# Altium schematic sheet S7CAS-PLEIADES-CARTE-MERE_P02_DDR3.SchDoc
size Tabloid; DocumentNumber: 8; SheetNumber: 8; SheetTotal: 14; Size: 11x17; Sheet_Name: DDR3
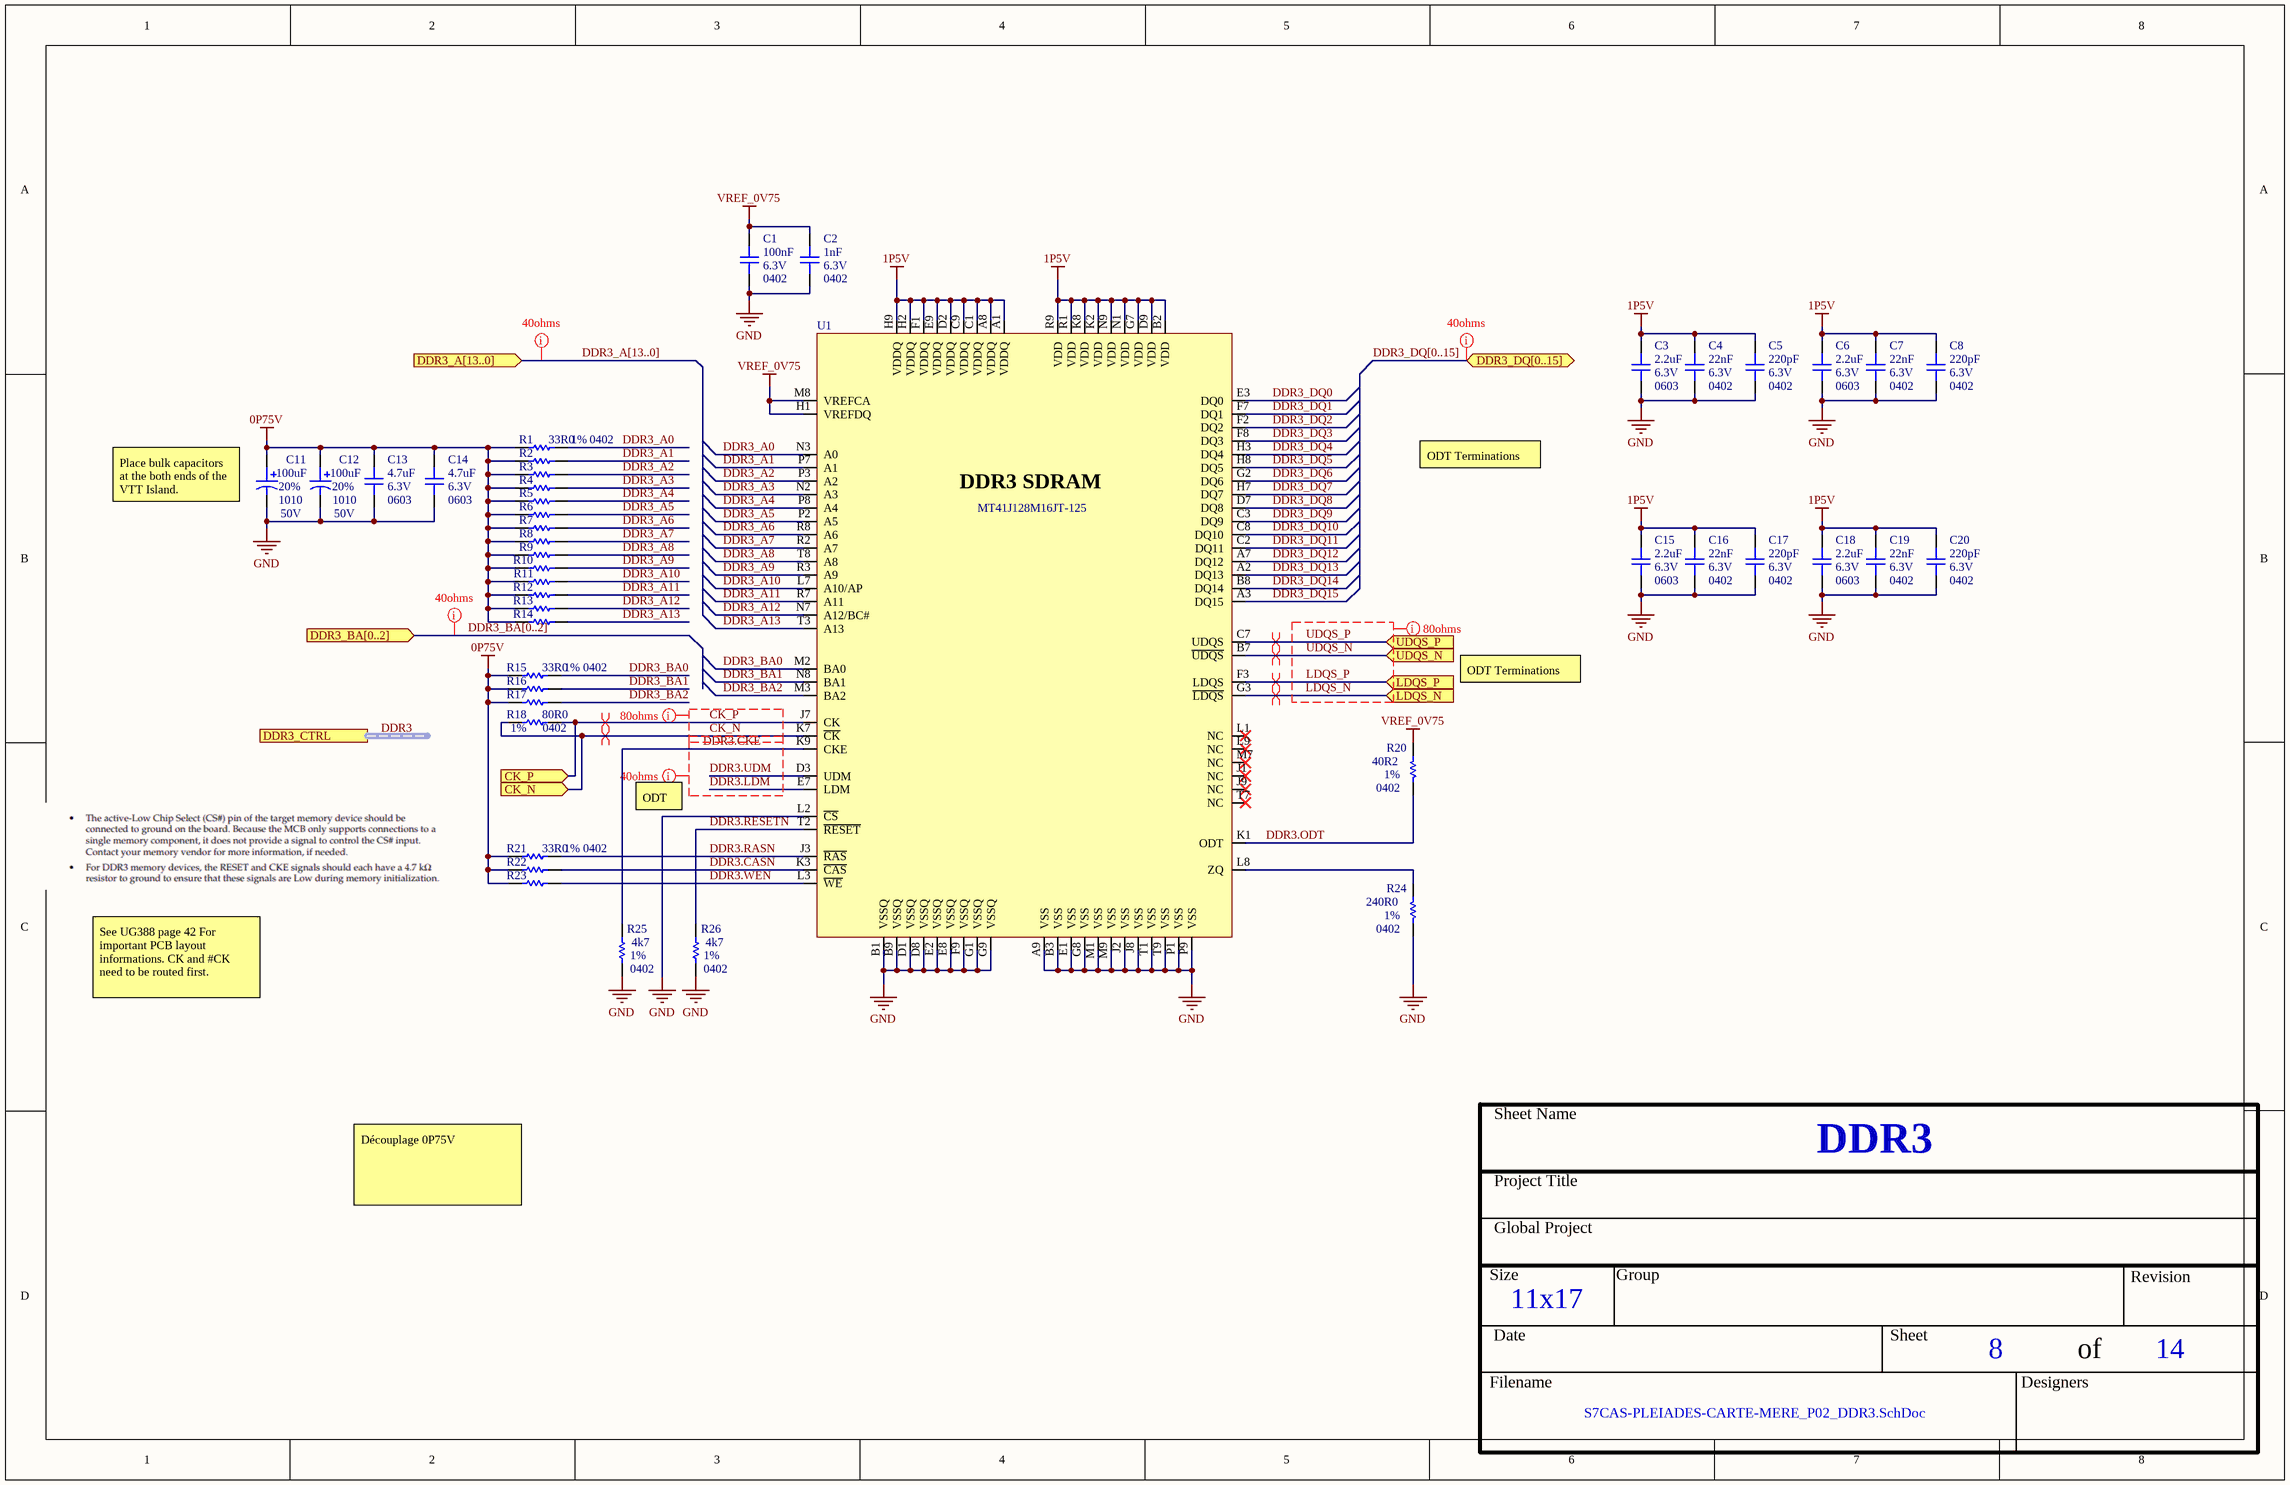
[diagram p0: S7CAS-PLEIADES-CARTE-MERE_P02_DDR3.SchDoc]

## Parts
C1  value 100nF  Voltage: 6.3V  Package: 0402  [CAP_0402]  (hidden comment: CAP - 0402)
C2  value 1nF  Voltage: 6.3V  Package: 0402  [CAP_0402]  (hidden comment: CAP - 0402)
C3  value 2.2uF  Voltage: 6.3V  Package: 0603  [CAP_0603]  (hidden comment: CAP - 0603)
C4  value 22nF  Voltage: 6.3V  Package: 0402  [CAP_0402]  (hidden comment: CAP - 0402)
C5  value 220pF  Voltage: 6.3V  Package: 0402  [CAP_0402]  (hidden comment: CAP - 0402)
C6  value 2.2uF  Voltage: 6.3V  Package: 0603  [CAP_0603]  (hidden comment: CAP - 0603)
C7  value 22nF  Voltage: 6.3V  Package: 0402  [CAP_0402]  (hidden comment: CAP - 0402)
C8  value 220pF  Voltage: 6.3V  Package: 0402  [CAP_0402]  (hidden comment: CAP - 0402)
C11  value 100uF  Voltage: 50V  Package: 1010  Precision: 20%  [CAP_ALU_1010_vishay]  (hidden comment: MAL215099101E3)
C12  value 100uF  Voltage: 50V  Package: 1010  Precision: 20%  [CAP_ALU_1010_vishay]  (hidden comment: MAL215099101E3)
C13  value 4.7uF  Voltage: 6.3V  Package: 0603  [CAP_0603]  (hidden comment: CAP - 0603)
C14  value 4.7uF  Voltage: 6.3V  Package: 0603  [CAP_0603]  (hidden comment: CAP - 0603)
C15  value 2.2uF  Voltage: 6.3V  Package: 0603  [CAP_0603]  (hidden comment: CAP - 0603)
C16  value 22nF  Voltage: 6.3V  Package: 0402  [CAP_0402]  (hidden comment: CAP - 0402)
C17  value 220pF  Voltage: 6.3V  Package: 0402  [CAP_0402]  (hidden comment: CAP - 0402)
C18  value 2.2uF  Voltage: 6.3V  Package: 0603  [CAP_0603]  (hidden comment: CAP - 0603)
C19  value 22nF  Voltage: 6.3V  Package: 0402  [CAP_0402]  (hidden comment: CAP - 0402)
C20  value 220pF  Voltage: 6.3V  Package: 0402  [CAP_0402]  (hidden comment: CAP - 0402)
R1  value 33R0  Package: 0402  Precision: 1%  [RES_0402]  (hidden comment: RES - 0402)
R2  RES - 0402  [RES_0402]  (value not drawn)
R3  RES - 0402  [RES_0402]  (value not drawn)
R4  RES - 0402  [RES_0402]  (value not drawn)
R5  RES - 0402  [RES_0402]  (value not drawn)
R6  RES - 0402  [RES_0402]  (value not drawn)
R7  RES - 0402  [RES_0402]  (value not drawn)
R8  RES - 0402  [RES_0402]  (value not drawn)
R9  RES - 0402  [RES_0402]  (value not drawn)
R10  RES - 0402  [RES_0402]  (value not drawn)
R11  RES - 0402  [RES_0402]  (value not drawn)
R12  RES - 0402  [RES_0402]  (value not drawn)
R13  RES - 0402  [RES_0402]  (value not drawn)
R14  RES - 0402  [RES_0402]  (value not drawn)
R15  value 33R0  Package: 0402  Precision: 1%  [RES_0402]  (hidden comment: RES - 0402)
R16  RES - 0402  [RES_0402]  (value not drawn)
R17  RES - 0402  [RES_0402]  (value not drawn)
R18  value 80R0  Package: 0402  Precision: 1%  [RES_0402]  (hidden comment: RES - 0402)
R20  value 40R2  Package: 0402  Precision: 1%  [RES_0402]  (hidden comment: RES - 0402)
R21  value 33R0  Package: 0402  Precision: 1%  [RES_0402]  (hidden comment: RES - 0402)
R22  RES - 0402  [RES_0402]  (value not drawn)
R23  RES - 0402  [RES_0402]  (value not drawn)
R24  value 240R0  Package: 0402  Precision: 1%  [RES_0402]  (hidden comment: RES - 0402)
R25  value 4k7  Package: 0402  Precision: 1%  [RES_0402]  (hidden comment: RES - 0402)
R26  value 4k7  Package: 0402  Precision: 1%  [RES_0402]  (hidden comment: RES - 0402)
U1  MT41J128M16JT-125  [MEM_DDR3_MT41J128M16JT-125]

## Ports
CK_N (in), CK_P (in), DDR3_A[13..0] (in), DDR3_BA[0..2] (in), DDR3_CTRL (harness DDR_CTRL), DDR3_DQ[0..15] (bidir), LDQS_N (in), LDQS_P (in), UDQS_N (in), UDQS_P (in)

## Nets
0P75V: C11.1 C12.1 C13.2 C14.2 R1.2 R2.2 R3.2 R4.2 R5.2 R6.2 R7.2 R8.2 R9.2 R10.2 R11.2 R12.2 R13.2 R14.2 R15.2 R16.2 R17.2 R21.2 R22.2 R23.2
1P5V: C3.2 C4.2 C5.2 C6.2 C7.2 C8.2 C15.2 C16.2 C17.2 C18.2 C19.2 C20.2 U1.A1(VDDQ) U1.A8(VDDQ) U1.B2(VDD) U1.C1(VDDQ) U1.C9(VDDQ) U1.D2(VDDQ) U1.D9(VDD) U1.E9(VDDQ) U1.F1(VDDQ) U1.G7(VDD) U1.H2(VDDQ) U1.H9(VDDQ) U1.K2(VDD) U1.K8(VDD) U1.N1(VDD) U1.N9(VDD) U1.R1(VDD) U1.R9(VDD)
GND: C1.1 C2.1 C3.1 C4.1 C5.1 C6.1 C7.1 C8.1 C11.2 C12.2 C13.1 C14.1 C15.1 C16.1 C17.1 C18.1 C19.1 C20.1 R24.1 R25.1 R26.1 U1.A9(VSS) U1.B1(VSSQ) U1.B3(VSS) U1.B9(VSSQ) U1.D1(VSSQ) U1.D8(VSSQ) U1.E1(VSS) U1.E2(VSSQ) U1.E8(VSSQ) U1.F9(VSSQ) U1.G1(VSSQ) U1.G8(VSS) U1.G9(VSSQ) U1.J2(VSS) U1.J8(VSS) U1.L2(~{CS}) U1.M1(VSS) U1.M9(VSS) U1.P1(VSS) U1.P9(VSS) U1.T1(VSS) U1.T9(VSS)
VREF_0V75: C1.2 C2.2 R20.2 U1.H1(VREFDQ) U1.M8(VREFCA)
CK_N: R18.2 U1.K7(~{CK}) ; port CK_N
CK_P: R18.1 U1.J7(CK) ; port CK_P
DDR3.CASN: R22.1 U1.K3(~{CAS})
DDR3.CKE: R25.2 U1.K9(CKE)
DDR3.LDM: U1.E7(LDM)
DDR3.ODT: R20.1 U1.K1(ODT)
DDR3.RASN: R21.1 U1.J3(~{RAS})
DDR3.RESETN: R26.2 U1.T2(~{RESET})
DDR3.UDM: U1.D3(UDM)
DDR3.WEN: R23.1 U1.L3(~{WE})
DDR3_A0: R1.1 U1.N3(A0)
DDR3_A1: R2.1 U1.P7(A1)
DDR3_A2: R3.1 U1.P3(A2)
DDR3_A3: R4.1 U1.N2(A3)
DDR3_A4: R5.1 U1.P8(A4)
DDR3_A5: R6.1 U1.P2(A5)
DDR3_A6: R7.1 U1.R8(A6)
DDR3_A7: R8.1 U1.R2(A7)
DDR3_A8: R9.1 U1.T8(A8)
DDR3_A9: R10.1 U1.R3(A9)
DDR3_A10: R11.1 U1.L7(A10/AP)
DDR3_A11: R12.1 U1.R7(A11)
DDR3_A12: R13.1 U1.N7(A12/BC#)
DDR3_A13: R14.1 U1.T3(A13)
DDR3_BA0: R15.1 U1.M2(BA0)
DDR3_BA1: R16.1 U1.N8(BA1)
DDR3_BA2: R17.1 U1.M3(BA2)
DDR3_DQ0: U1.E3(DQ0)
DDR3_DQ1: U1.F7(DQ1)
DDR3_DQ2: U1.F2(DQ2)
DDR3_DQ3: U1.F8(DQ3)
DDR3_DQ4: U1.H3(DQ4)
DDR3_DQ5: U1.H8(DQ5)
DDR3_DQ6: U1.G2(DQ6)
DDR3_DQ7: U1.H7(DQ7)
DDR3_DQ8: U1.D7(DQ8)
DDR3_DQ9: U1.C3(DQ9)
DDR3_DQ10: U1.C8(DQ10)
DDR3_DQ11: U1.C2(DQ11)
DDR3_DQ12: U1.A7(DQ12)
DDR3_DQ13: U1.A2(DQ13)
DDR3_DQ14: U1.B8(DQ14)
DDR3_DQ15: U1.A3(DQ15)
LDQS_N: U1.G3(~{LDQS}) ; port LDQS_N
LDQS_P: U1.F3(LDQS) ; port LDQS_P
UDQS_N: U1.B7(~{UDQS}) ; port UDQS_N
UDQS_P: U1.C7(UDQS) ; port UDQS_P
NetR24_2: R24.2 U1.L8(ZQ)

Not connected (* = marked no-connect by the designer): U1 J1(NC)* J9(NC)* L1(NC)* L9(NC)* M7(NC)* T7(NC)*

## Buses and harness runs
bus DDR3_A[13..0] = port DDR3_A[13..0]
bus DDR3_BA[0..2] = port DDR3_BA[0..2]
bus DDR3_DQ[0..15] = port DDR3_DQ[0..15]
harness DDR3 = port DDR3_CTRL

## Layout directives
differential pair: CK_N, CK_P, LDQS_N, LDQS_P, UDQS_N, UDQS_P
net class 40ohms: (no net found under the mark), CK_N, DDR3.CKE, DDR3.LDM, DDR3.UDM
net class 80ohms: CK_N, CK_P, LDQS_N, LDQS_P, UDQS_N, UDQS_P

## Notes on the sheet
- (near C11) Place bulk capacitors at the both ends of the VTT Island.
- ODT Terminations
- ODT
- See UG388 page 42 For important PCB layout informations. CK and #CK need to be routed first.
- Découplage 0P75V
- Sheet Name
- Project Title
- Global Project
- Size
- Group
- Revision
- Date
- Sheet
- of
- Filename
- Designers
- (in symbol MEM_DDR3_MT41J128M16JT-125:K TR) DDR3 SDRAM

## Library data of the parts
C1 C2 C4 C5 C7 C8 C16 C17 C19 C20 = CAP - 0402: Mfg Part Number: GRM022R60J104KE15; Mfg: Murata; Precision: 10%; Current: *; CreatedBy: Jonathan Bouchard; Power: *
C3 C6 C13-C15 C18 = CAP - 0603: Precision: 10%; Current: *; CreatedBy: Jonathan Bouchard; Power: *
C11 C12 = CAP_ALU_MAL215099101E3: CAP - ALU 100uF 20% 50V - 1010; Current: 490mA; Mfg: Vishay Dale; Mfg Part Number: MAL215099101E3; HelpURL: http://www.vishay.com/docs/28395/150crz.pdf; CreatedBy: Jonathan Bouchard; Temperature: -55°C to 125°C; Power: *; Supplier 1: Digikey; Supplier Part Number 1: 4399PHDKR-ND
R1-R18 R20-R26 = RES - 0402: Voltage: 50V; Power: 1/16W; Current: *; CreatedBy: Jonathan Bouchard
U1 = MEM_DDR3_MT41J128M16JT-125:K TR: MEM - DDR3 SDRAM 2GBIT 800MHZ - TFBGA-96; Voltage: 1.425 V ~ 1.575 V; Mfg: Micrel; Current: *; Power: *; Mfg Part Number: http://www.micron.com/~/media/Documents/Products/Data%20Sheet/DRAM/DDR3/2Gb_DDR3_SDRAM.pdf; HelpURL: http://ww1.microchip.com/downloads/en/DeviceDoc/00002275A.pdf; CreatedBy: Jonathan Bouchard; Temperature: 0°C ~ 95°C (TC); Value: *; Precision: *; Package: TFBGA-96; Supplier 1: Digikey; Supplier Part Number 1: 557-1611-1-ND